# EAGLE design untitled1sch (EAGLE 6.6.0)
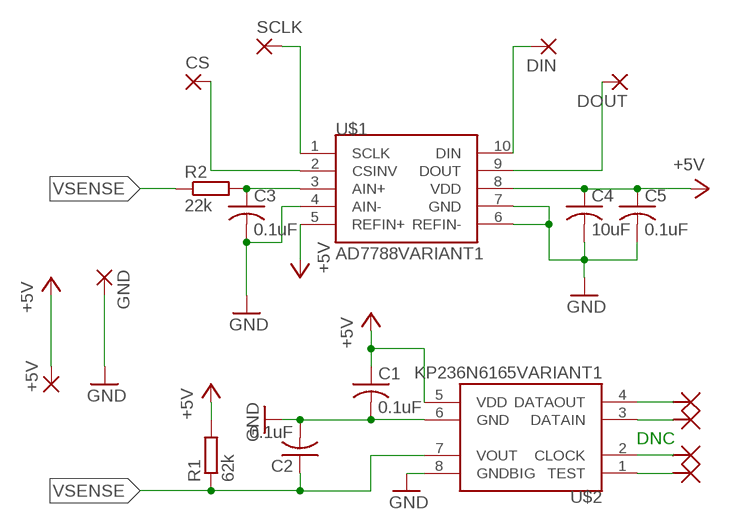
[diagram p0: schematic, sheet 1]

## Parts
+5V  WIREPAD1,6/0,8  [1,6/0,8]
C1  0.1uF  C-USC0805  [C0805]
C2  0.1uF  C-USC0805  [C0805]
C3  0.1uF  C-USC0805  [C0805]
C4  10uF  C-USC0805  [C0805]
C5  0.1uF  C-USC0805  [C0805]
CS  WIREPAD1,6/0,8  [1,6/0,8]
DIN  WIREPAD1,6/0,8  [1,6/0,8]
DOUT  WIREPAD1,6/0,8  [1,6/0,8]
GND  WIREPAD1,6/0,8  [1,6/0,8]
R1  62k  R-EU_R0603  [R0603]
R2  22k  R-EU_R0603  [R0603]
SCLK  WIREPAD1,6/0,8  [1,6/0,8]
U$1  AD7788VARIANT1  [AD7788]
U$2  KP236N6165VARIANT1  [KP236N6165]

## Nets
+5V: +5V.1(P) C1.1 C4.1 C5.1 R1.2 U$1.5(REFIN+) U$1.8(VDD) U$2.5(VDD)
GND: C1.2 C2.2 C3.2 C4.2 C5.2 GND.1(P) U$1.4(AIN-) U$1.6(REFIN-) U$1.7(GND) U$2.6(GND) U$2.8(GNDBIG)
N$1: CS.1(P) U$1.2(CSINV)
N$2: U$2.1(TEST)
N$3: DIN.1(P) U$1.10(DIN)
N$4: DOUT.1(P) U$1.9(DOUT)
N$5: U$2.2(CLOCK)
N$6: U$2.3(DATAIN)
N$7: U$2.4(DATAOUT)
RENAMED: C3.1 R2.2 U$1.3(AIN+)
SCLK: SCLK.1(P) U$1.1(SCLK)
VSENSE: C2.1 R1.1 R2.1 U$2.7(VOUT)

## Notes on the sheet
- DNC

## Library data of the parts
+5V CS DIN DOUT GND SCLK = wirepad:WIREPAD: Wire PAD connect wire on PCB
C1-C5 = rcl:C-US: CAPACITOR, American symbol
R1 R2 = rcl:R-EU_: RESISTOR, European symbol
U$1 = evan1:AD7788
U$2 = evan1:KP236N6165

## Board
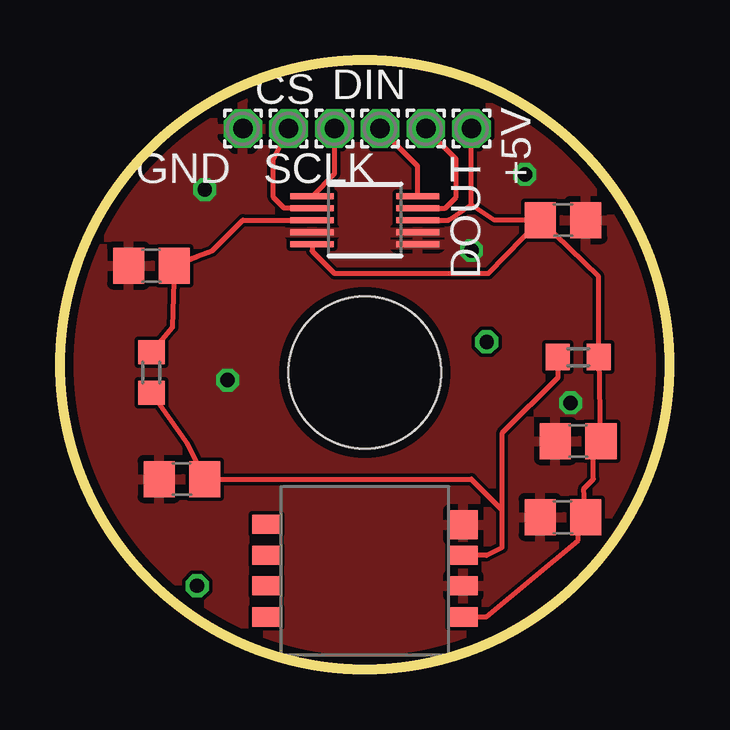
[diagram p1: board, top side]
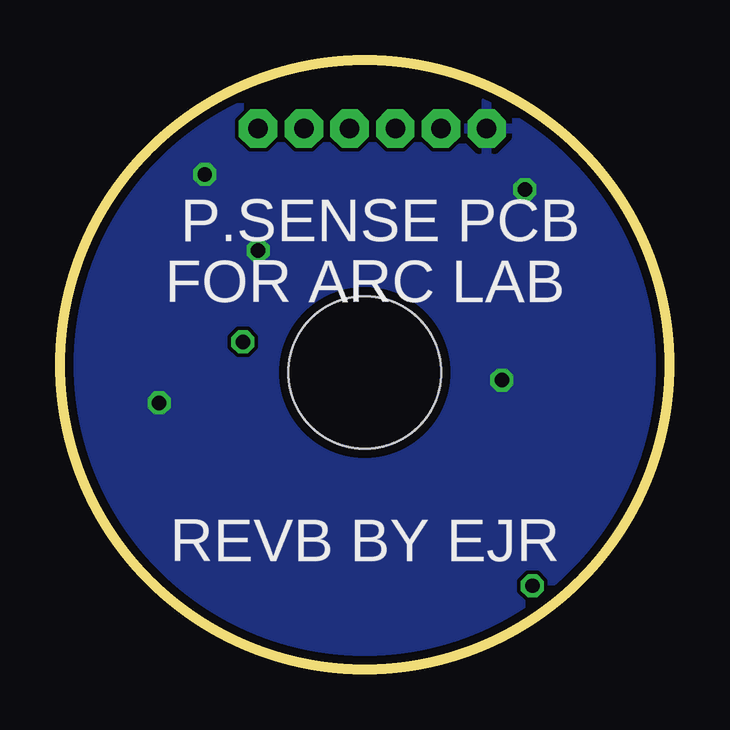
[diagram p2: board, bottom side, seen from below]

Size 25.4 x 25.4 mm. Coordinates in mm from the lower left corner, seen from the top.
Outline: circle at 12.7,12.7 radius 12.7
Copper layers (1*16): Top 0.0356mm / dielectric 1.5011mm / Bottom 0.0356mm
Design rules "OSHParkPCBOrder": minimum track width 6mil, minimum drill 13mil, track to track 6mil, track to pad 6mil, pad to pad 6mil, via to via 6mil, smd to smd 6mil, copper to edge 15mil, drill to drill 6mil, minimum pad ring 7mil, minimum via ring 7mil, stop-mask expansion 3mil, vias tented up to drill 0mil, thermal gap 10mil
Holes 6.35 mm at 12.7,12.38

### Footprints (pad centres in the part's own frame; a part is rotated, then mirrored left to right if it is on the bottom)
1,6/0,8 = drill 0.813 pad 1.6 octagon: 1 0,0
C0805 = smd 1.3 x 1.5: 1 -0.95,0; 2 0.95,0
R0603 = smd 1 x 1.1: 1 -0.85,0; 2 0.85,0
AD7788 = smd 1.8 x 0.25: 1 -2.2,1; 2 -2.2,0.5; 3 -2.2,0; 4 -2.2,-0.5; 5 -2.2,-1; 6 2.2,-1; 7 2.2,-0.5; 8 2.2,0; 9 2.2,0.5; 10 2.2,1
KP236N6165 = smd 1.2 x 0.8: 1 -4.1,1.935; 2 -4.1,0.635; 3 -4.1,-0.635; 4 -4.1,-1.935; 5 4.1,-1.935; 6 4.1,-0.635; 7 4.1,0.635 | smd 1.2 x 1.2: 8 4.1,1.905

### Placement (x,y rotation side)
+5V  17.14,22.54 0 top
C1  20.95,18.73 0 top
C2  5.08,7.94 180 top
C3  3.81,16.83 180 top
C4  20.95,6.35 180 top
C5  21.59,9.52 180 top
CS  9.53,22.54 0 top
DIN  13.34,22.54 0 top
DOUT  15.24,22.54 270 top
GND  7.62,22.54 0 top
R1  21.59,13.02 0 top
R2  3.81,12.38 90 top
SCLK  11.43,22.54 180 top
U$1  12.7,18.73 0 top
U$2  12.7,4.13 0 top

### Tracks (layer width: path | path; a pad name or v marks a point on that pad's centre or on a via)
+5V
  Top 0.203: U$2.5 17.75,2.19 21.59,5.4 21.59,6.43 C4.1 21.83,7.54 22.23,7.94 22.23,8.97 C5.1 22.46,12.99 R1.2 22.44,16.37 C1.1 | U$1.5 10.5,17.44 11.43,16.51 17.86,16.51 C1.1 | U$1.8 16.19,18.73 17.14,19.37 | 17.14,19.37 +5V.1 | C1.1 18.1,18.73 17.14,19.37
GND  (via drill 0.6)
  other vias: 17.14,17.46 19.37,20.64 6.03,20 21.27,11.11 6.99,12.06
  pour Bottom: 0,-0.32 3.81,-0.32 3.81,-1.59 20.32,-1.59 20.32,-0.32 26.67,-0.32 26.67,26.35 -1.27,26.35 -1.27,-0.32
  pour Top: -1.27,0.32 -0.64,0.32 -0.64,23.18 4.45,23.18 4.45,27.62 26.67,27.62 26.67,-4.13 -1.27,-4.13
N$1
  Top 0.203: U$1.2 9.34,19.23 8.89,19.69 8.89,21.27 CS.1
N$3
  Top 0.203: U$1.10 14.9,20.98 DIN.1
N$4
  Top 0.203: U$1.9 16.06,19.23 16.51,19.69 16.51,21.27 DOUT.1
N$9  (via drill 0.6)
  other vias: 5.71,3.49
N$10  (via drill 0.6)
  other vias: 17.78,13.65
RENAMED
  Top 0.203: R2.2 4.68,14.26 C3.1 5.71,17.22 6.35,17.46 7.62,18.73 U$1.3
SCLK
  Top 0.203: SCLK.1 11.43,20.66 U$1.1
VSENSE
  Top 0.203: R2.1 5.32,9.39 C2.1 17.14,7.94 18.41,6.67 | 18.41,6.67 18.41,9.84 20.74,12.17 R1.1 | 18.41,6.67 18.41,5.08 17.78,4.76 U$2.7

### Text on the board
bNames: P.SENSE PCB | FOR ARC LAB | REVB BY EJR